# Altium project mcu_ecg_combine_board.PrjPCB
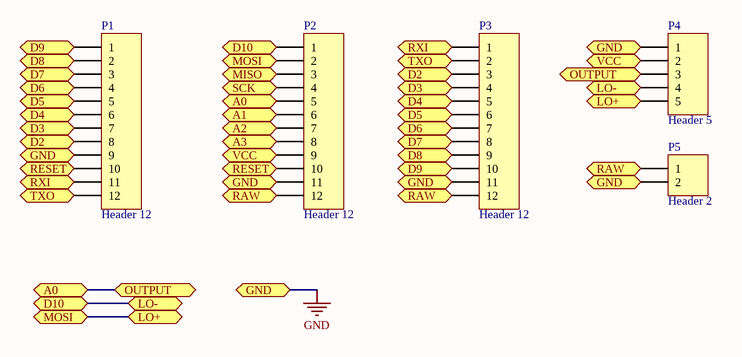
[diagram p0: mcu.SchDoc]
1 sheet, 5 parts. Net scope: flat (ports and power ports of the same name join across sheets).
Board file: mcu_ecg_combine_board.PcbDoc

## Sheet mcu.SchDoc
size A

### Parts
P1  Header 12  [HDR1X12]
P2  Header 12  [HDR1X12]
P3  Header 12  [HDR1X12]
P4  Header 5  [HDR1X5]
P5  Header 2  [HDR1X2]

### Ports
A0, A1, A2, A3, D2, D3, D4, D5, D6, D7, D8, D9, D10, GND, LO+, LO-, MISO, MOSI, OUTPUT, RAW, RESET, RXI, SCK, TXO, VCC

### Nets
GND: P1.9 P2.11 P3.11 P4.1 P5.2 ; port GND
NetP1_1: P1.1 P3.10 ; port D9
NetP1_2: P1.2 P3.9 ; port D8
NetP1_3: P1.3 P3.8 ; port D7
NetP1_4: P1.4 P3.7 ; port D6
NetP1_5: P1.5 P3.6 ; port D5
NetP1_6: P1.6 P3.5 ; port D4
NetP1_7: P1.7 P3.4 ; port D3
NetP1_8: P1.8 P3.3 ; port D2
NetP1_10: P1.10 P2.10 ; port RESET
NetP1_11: P1.11 P3.1 ; port RXI
NetP1_12: P1.12 P3.2 ; port TXO
NetP2_1: P2.1 P4.4 ; port D10, port LO-
NetP2_2: P2.2 P4.5 ; port MOSI, port LO+
NetP2_3: P2.3 ; port MISO
NetP2_4: P2.4 ; port SCK
NetP2_5: P2.5 P4.3 ; port A0, port OUTPUT
NetP2_6: P2.6 ; port A1
NetP2_7: P2.7 ; port A2
NetP2_8: P2.8 ; port A3
NetP2_9: P2.9 P4.2 ; port VCC
NetP2_12: P2.12 P3.12 P5.1 ; port RAW

### Library data of the parts
P1-P3 = Header 12: Header, 12-Pin; LatestRevisionDate: 17-Jul-2002; LatestRevisionNote: Re-released for DXP Platform.; Publisher: Altium Limited
P4 = Header 5: Header, 5-Pin; LatestRevisionDate: 17-Jul-2002; LatestRevisionNote: Re-released for DXP Platform.; Publisher: Altium Limited
P5 = Header 2: Header, 2-Pin; LatestRevisionDate: 17-Jul-2002; LatestRevisionNote: Re-released for DXP Platform.; Publisher: Altium Limited